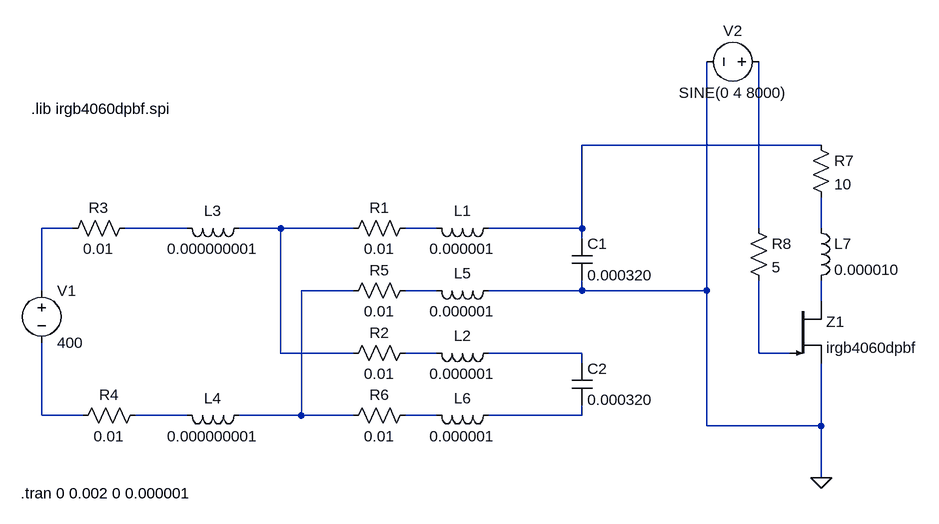
[diagram p0: schematic inverter-spice.asc]
inverter-spice.asc, the LTspice schematic file:
Version 4
SHEET 1 1416 680
WIRE 1248 -64 880 -64
WIRE 96 64 48 64
WIRE 272 64 176 64
WIRE 416 64 352 64
WIRE 528 64 416 64
WIRE 656 64 608 64
WIRE 880 64 880 -64
WIRE 880 64 736 64
WIRE 1152 64 1152 -192
WIRE 1248 64 1248 16
WIRE 880 80 880 64
WIRE 48 160 48 64
WIRE 528 160 448 160
WIRE 656 160 608 160
WIRE 880 160 880 144
WIRE 880 160 736 160
WIRE 1072 160 1072 -192
WIRE 1072 160 880 160
WIRE 1248 176 1248 144
WIRE 416 256 416 64
WIRE 528 256 416 256
WIRE 656 256 608 256
WIRE 880 256 736 256
WIRE 1152 256 1152 144
WIRE 1200 256 1152 256
WIRE 880 272 880 256
WIRE 48 352 48 240
WIRE 112 352 48 352
WIRE 272 352 192 352
WIRE 448 352 448 160
WIRE 448 352 352 352
WIRE 528 352 448 352
WIRE 656 352 608 352
WIRE 880 352 880 336
WIRE 880 352 736 352
WIRE 1072 368 1072 160
WIRE 1248 368 1248 272
WIRE 1248 368 1072 368
WIRE 1248 448 1248 368
FLAG 1248 448 0
SYMBOL voltage 48 144 R0
WINDOW 123 0 0 Left 0
WINDOW 39 0 0 Left 0
SYMATTR InstName V1
SYMATTR Value 400
SYMBOL res 192 48 R90
WINDOW 0 0 56 VBottom 2
WINDOW 3 32 56 VTop 2
SYMATTR InstName R3
SYMATTR Value 0.01
SYMBOL res 208 336 R90
WINDOW 0 0 56 VBottom 2
WINDOW 3 32 56 VTop 2
SYMATTR InstName R4
SYMATTR Value 0.01
SYMBOL ind 368 48 R90
WINDOW 0 5 56 VBottom 2
WINDOW 3 32 56 VTop 2
SYMATTR InstName L3
SYMATTR Value 0.000000001
SYMBOL ind 368 336 R90
WINDOW 0 5 56 VBottom 2
WINDOW 3 32 56 VTop 2
SYMATTR InstName L4
SYMATTR Value 0.000000001
SYMBOL res 624 48 R90
WINDOW 0 0 56 VBottom 2
WINDOW 3 32 56 VTop 2
SYMATTR InstName R1
SYMATTR Value 0.01
SYMBOL res 624 144 R90
WINDOW 0 0 56 VBottom 2
WINDOW 3 32 56 VTop 2
SYMATTR InstName R5
SYMATTR Value 0.01
SYMBOL res 624 240 R90
WINDOW 0 0 56 VBottom 2
WINDOW 3 32 56 VTop 2
SYMATTR InstName R2
SYMATTR Value 0.01
SYMBOL res 624 336 R90
WINDOW 0 0 56 VBottom 2
WINDOW 3 32 56 VTop 2
SYMATTR InstName R6
SYMATTR Value 0.01
SYMBOL ind 752 48 R90
WINDOW 0 5 56 VBottom 2
WINDOW 3 32 56 VTop 2
SYMATTR InstName L1
SYMATTR Value 0.000001
SYMBOL ind 752 144 R90
WINDOW 0 5 56 VBottom 2
WINDOW 3 32 56 VTop 2
SYMATTR InstName L5
SYMATTR Value 0.000001
SYMBOL ind 752 240 R90
WINDOW 0 5 56 VBottom 2
WINDOW 3 32 56 VTop 2
SYMATTR InstName L2
SYMATTR Value 0.000001
SYMBOL ind 752 336 R90
WINDOW 0 5 56 VBottom 2
WINDOW 3 32 56 VTop 2
SYMATTR InstName L6
SYMATTR Value 0.000001
SYMBOL cap 864 272 R0
SYMATTR InstName C2
SYMATTR Value 0.000320
SYMBOL cap 864 80 R0
SYMATTR InstName C1
SYMATTR Value 0.000320
SYMBOL res 1232 -80 R0
SYMATTR InstName R7
SYMATTR Value 10
SYMBOL res 1136 48 R0
SYMATTR InstName R8
SYMATTR Value 5
SYMBOL ind 1232 48 R0
SYMATTR InstName L7
SYMATTR Value 0.000010
SYMBOL Misc\\NIGBT 1200 176 R0
SYMATTR InstName Z1
SYMATTR Value irgb4060dpbf
SYMATTR Prefix X
SYMBOL voltage 1168 -192 R90
WINDOW 0 -32 56 VBottom 2
WINDOW 3 32 56 VTop 2
WINDOW 123 0 0 Left 0
WINDOW 39 0 0 Left 0
SYMATTR InstName V2
SYMATTR Value SINE(0 4 8000)
TEXT 32 -120 Left 2 !.lib irgb4060dpbf.spi
TEXT 16 472 Left 2 !.tran 0 0.002 0 0.000001

The netlist it stands for:
* inverter-spice.asc
V1 N002 N014 400
R3 N003 N002 0.01
R4 N015 N014 0.01
L3 N004 N003 0.000000001
L4 N008 N015 0.000000001
R1 N005 N004 0.01
R5 N009 N008 0.01
R2 N011 N004 0.01
R6 N016 N008 0.01
L1 N001 N005 0.000001
L5 0 N009 0.000001
L2 N012 N011 0.000001
L6 N017 N016 0.000001
C2 N012 N017 0.000320
C1 N001 0 0.000320
R7 N001 N007 10
R8 N006 N013 5
L7 N007 N010 0.000010
XZ1 N010 N013 0 irgb4060dpbf  ; pins C G E
V2 N006 0 SINE(0 4 8000)
.lib irgb4060dpbf.spi
.tran 0 0.002 0 0.000001
.backanno
.end